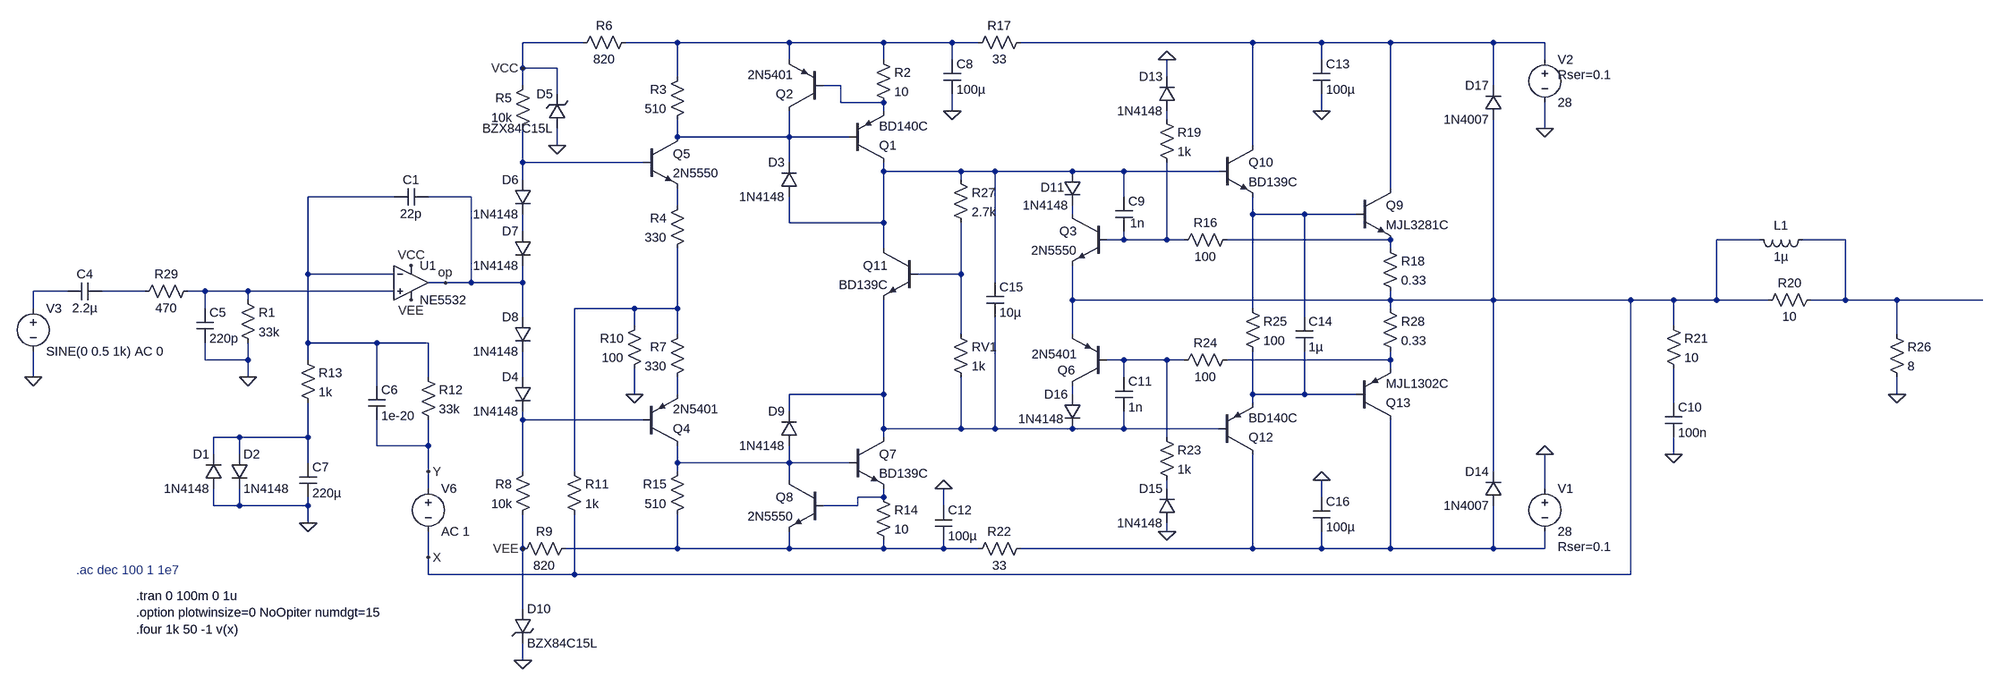
[diagram p0: schematic opamp-classabs.asc]
opamp-classabs.asc, the LTspice schematic file:
Version 4
SHEET 1 3044 900
WIRE 432 -272 320 -272
WIRE 608 -272 512 -272
WIRE 816 -272 608 -272
WIRE 992 -272 816 -272
WIRE 1120 -272 992 -272
WIRE 1168 -272 1120 -272
WIRE 1680 -272 1248 -272
WIRE 1808 -272 1680 -272
WIRE 1936 -272 1808 -272
WIRE 2128 -272 1936 -272
WIRE 2224 -272 2128 -272
WIRE 816 -240 816 -272
WIRE 992 -240 992 -272
WIRE 1120 -240 1120 -272
WIRE 1808 -240 1808 -272
WIRE 2224 -240 2224 -272
WIRE 320 -224 320 -272
WIRE 384 -224 320 -224
WIRE 608 -208 608 -272
WIRE 1520 -208 1520 -240
WIRE 320 -192 320 -224
WIRE 912 -192 880 -192
WIRE 2128 -192 2128 -272
WIRE 384 -176 384 -224
WIRE 912 -160 912 -192
WIRE 992 -160 912 -160
WIRE 992 -144 992 -160
WIRE 1120 -144 1120 -176
WIRE 1808 -144 1808 -176
WIRE 1520 -128 1520 -144
WIRE 2224 -112 2224 -160
WIRE 608 -96 608 -128
WIRE 816 -96 816 -144
WIRE 816 -96 608 -96
WIRE 928 -96 816 -96
WIRE 384 -80 384 -112
WIRE 1680 -80 1680 -272
WIRE 320 -48 320 -112
WIRE 544 -48 320 -48
WIRE 816 -48 816 -96
WIRE 992 -32 992 -48
WIRE 1136 -32 992 -32
WIRE 1200 -32 1136 -32
WIRE 1344 -32 1200 -32
WIRE 1440 -32 1344 -32
WIRE 1616 -32 1440 -32
WIRE 320 -16 320 -48
WIRE 1136 -16 1136 -32
WIRE 1936 0 1936 -272
WIRE 80 16 -80 16
WIRE 224 16 144 16
WIRE 1440 16 1440 -32
WIRE 608 32 608 0
WIRE 1344 48 1344 32
WIRE 1680 48 1680 16
WIRE 1776 48 1680 48
WIRE 1872 48 1776 48
WIRE 816 64 816 16
WIRE 992 64 992 -32
WIRE 992 64 816 64
WIRE 320 80 320 48
WIRE 1440 96 1440 80
WIRE 1440 96 1408 96
WIRE 1520 96 1520 -48
WIRE 1520 96 1440 96
WIRE 1552 96 1520 96
WIRE 1936 96 1632 96
WIRE 2624 96 2544 96
WIRE 2784 96 2704 96
WIRE 992 112 992 64
WIRE 1936 112 1936 96
WIRE -80 160 -80 16
WIRE 80 160 -80 160
WIRE 1136 160 1136 64
WIRE 1136 160 1056 160
WIRE 176 176 144 176
WIRE 224 176 224 16
WIRE 224 176 176 176
WIRE 320 176 320 144
WIRE 320 176 224 176
WIRE 1200 176 1200 -32
WIRE -528 192 -592 192
WIRE -384 192 -464 192
WIRE -272 192 -304 192
WIRE -192 192 -272 192
WIRE 80 192 -192 192
WIRE -192 208 -192 192
WIRE 1344 208 1344 144
WIRE 1936 208 1936 192
WIRE 1936 208 1344 208
WIRE 2128 208 2128 -128
WIRE 2128 208 1936 208
WIRE 2384 208 2128 208
WIRE 2464 208 2384 208
WIRE 2544 208 2544 96
WIRE 2544 208 2464 208
WIRE 2640 208 2544 208
WIRE 2784 208 2784 96
WIRE 2784 208 2720 208
WIRE 2880 208 2784 208
WIRE 3040 208 2880 208
WIRE -592 224 -592 192
WIRE -272 224 -272 192
WIRE 528 224 416 224
WIRE 608 224 608 112
WIRE 608 224 528 224
WIRE 1680 224 1680 48
WIRE 1936 224 1936 208
WIRE 320 240 320 176
WIRE 1776 240 1776 48
WIRE 528 256 528 224
WIRE 2464 256 2464 208
WIRE 608 272 608 224
WIRE 1136 272 1136 160
WIRE 1344 272 1344 208
WIRE 2880 272 2880 208
WIRE -80 288 -80 160
WIRE 48 288 -80 288
WIRE 144 288 48 288
WIRE -272 320 -272 288
WIRE -192 320 -192 288
WIRE -192 320 -272 320
WIRE -80 320 -80 288
WIRE 1440 320 1408 320
WIRE 1520 320 1440 320
WIRE 1552 320 1520 320
WIRE 1936 320 1936 304
WIRE 1936 320 1632 320
WIRE 1936 336 1936 320
WIRE -592 352 -592 304
WIRE -192 352 -192 320
WIRE 144 352 144 288
WIRE 320 352 320 304
WIRE 1440 352 1440 320
WIRE 48 368 48 288
WIRE 528 384 528 336
WIRE 608 384 608 352
WIRE 992 384 992 208
WIRE 992 384 816 384
WIRE 1344 384 1344 368
WIRE 1680 384 1680 304
WIRE 1776 384 1776 304
WIRE 1776 384 1680 384
WIRE 1872 384 1776 384
WIRE 2880 384 2880 352
WIRE 1680 400 1680 384
WIRE 2464 400 2464 336
WIRE 816 416 816 384
WIRE 320 432 320 416
WIRE 544 432 320 432
WIRE 992 448 992 384
WIRE 1136 448 1136 352
WIRE 1136 448 992 448
WIRE 1200 448 1200 240
WIRE 1200 448 1136 448
WIRE 1344 448 1200 448
WIRE 1440 448 1440 416
WIRE 1440 448 1344 448
WIRE 1616 448 1440 448
WIRE -208 464 -256 464
WIRE -80 464 -80 400
WIRE -80 464 -208 464
WIRE 992 464 992 448
WIRE 1520 464 1520 320
WIRE 48 480 48 432
WIRE 144 480 144 432
WIRE 144 480 48 480
WIRE -256 496 -256 464
WIRE -208 496 -208 464
WIRE 2464 496 2464 464
WIRE -80 512 -80 464
WIRE 608 512 608 480
WIRE 816 512 816 480
WIRE 816 512 608 512
WIRE 928 512 816 512
WIRE 144 528 144 480
WIRE 320 528 320 432
WIRE 416 528 416 224
WIRE 608 528 608 512
WIRE 2128 528 2128 208
WIRE 816 544 816 512
WIRE 144 560 144 528
WIRE 1520 560 1520 544
WIRE 2224 560 2224 496
WIRE 992 576 992 560
WIRE 992 576 944 576
WIRE 1808 576 1808 544
WIRE -256 592 -256 560
WIRE -208 592 -208 560
WIRE -208 592 -256 592
WIRE -80 592 -80 576
WIRE -80 592 -208 592
WIRE 944 592 944 576
WIRE 944 592 880 592
WIRE 1104 592 1104 560
WIRE -80 624 -80 592
WIRE 1520 640 1520 624
WIRE 320 672 320 608
WIRE 608 672 608 608
WIRE 608 672 400 672
WIRE 816 672 816 640
WIRE 816 672 608 672
WIRE 992 672 992 656
WIRE 992 672 816 672
WIRE 1104 672 1104 656
WIRE 1104 672 992 672
WIRE 1168 672 1104 672
WIRE 1680 672 1680 496
WIRE 1680 672 1248 672
WIRE 1808 672 1808 640
WIRE 1808 672 1680 672
WIRE 1936 672 1936 432
WIRE 1936 672 1808 672
WIRE 2128 672 2128 592
WIRE 2128 672 1936 672
WIRE 2224 672 2224 640
WIRE 2224 672 2128 672
WIRE 144 688 144 640
WIRE 144 720 144 688
WIRE 416 720 416 608
WIRE 416 720 144 720
WIRE 2384 720 2384 208
WIRE 2384 720 416 720
WIRE 320 784 320 672
WIRE 320 880 320 848
FLAG -80 624 0
FLAG 112 144 VCC
FLAG 112 208 VEE
FLAG 2880 384 0
FLAG 2224 -112 0
FLAG 2224 496 0
FLAG -592 352 0
FLAG 144 688 X
FLAG 144 528 Y
FLAG -192 352 0
FLAG 176 176 op
FLAG 528 384 0
FLAG 1120 -144 0
FLAG 1104 560 0
FLAG 2464 496 0
FLAG 1808 -144 0
FLAG 1808 544 0
FLAG 1520 640 0
FLAG 1520 -240 0
FLAG 384 -80 0
FLAG 320 880 0
FLAG 320 672 VEE
FLAG 320 -224 VCC
DATAFLAG 688 -96 ""
DATAFLAG 992 0 ""
DATAFLAG 992 352 ""
DATAFLAG 672 512 ""
DATAFLAG 496 -48 ""
DATAFLAG 448 432 ""
SYMBOL NE5532 112 176 R0
SYMATTR InstName U1
SYMBOL res -96 304 R0
SYMATTR InstName R13
SYMATTR Value 1k
SYMBOL cap -96 512 R0
SYMATTR InstName C7
SYMATTR Value 220µ
SYMBOL res 128 336 R0
SYMATTR InstName R12
SYMATTR Value 33k
SYMBOL res 624 16 M0
SYMATTR InstName R4
SYMATTR Value 330
SYMBOL res 624 256 M0
SYMATTR InstName R7
SYMATTR Value 330
SYMBOL npn 544 -96 R0
SYMATTR InstName Q5
SYMATTR Value 2N5550
SYMBOL res 624 512 M0
SYMATTR InstName R15
SYMATTR Value 510
SYMBOL res 624 -224 M0
SYMATTR InstName R3
SYMATTR Value 510
SYMBOL diode 336 -16 M0
SYMATTR InstName D6
SYMATTR Value 1N4148
SYMBOL diode 336 80 M0
SYMATTR InstName D7
SYMATTR Value 1N4148
SYMBOL diode 336 352 M0
SYMATTR InstName D4
SYMATTR Value 1N4148
SYMBOL res 336 512 M0
SYMATTR InstName R8
SYMATTR Value 10k
SYMBOL res 336 -208 M0
SYMATTR InstName R5
SYMATTR Value 10k
SYMBOL pnp 928 -48 M180
SYMATTR InstName Q1
SYMATTR Value BD140C
SYMBOL res 976 -256 R0
SYMATTR InstName R2
SYMATTR Value 10
SYMBOL npn 1056 112 M0
SYMATTR InstName Q11
SYMATTR Value BD139C
SYMBOL npn 928 464 R0
SYMATTR InstName Q7
SYMATTR Value BD139C
SYMBOL res 976 560 R0
SYMATTR InstName R14
SYMATTR Value 10
SYMBOL cap 1184 176 R0
SYMATTR InstName C15
SYMATTR Value 10µ
SYMBOL res 1120 -32 R0
SYMATTR InstName R27
SYMATTR Value 2.7k
SYMBOL res 1120 256 R0
SYMATTR InstName RV1
SYMATTR Value 1k
SYMBOL npn 1616 -80 R0
SYMATTR InstName Q10
SYMATTR Value BD139C
SYMBOL pnp 1616 496 M180
SYMATTR InstName Q12
SYMATTR Value BD140C
SYMBOL res 1664 208 R0
SYMATTR InstName R25
SYMATTR Value 100
SYMBOL cap 1760 240 R0
SYMATTR InstName C14
SYMATTR Value 1µ
SYMBOL npn 1872 0 R0
SYMATTR InstName Q9
SYMATTR Value MJL3281C
SYMBOL pnp 1872 432 M180
SYMATTR InstName Q13
SYMATTR Value MJL1302C
SYMBOL res 1920 96 R0
SYMATTR InstName R18
SYMATTR Value 0.33
SYMBOL res 1920 208 R0
SYMATTR InstName R28
SYMATTR Value 0.33
SYMBOL voltage 2224 544 R0
WINDOW 123 0 0 Left 0
WINDOW 39 24 124 Left 2
SYMATTR SpiceLine Rser=0.1
SYMATTR InstName V1
SYMATTR Value 28
SYMBOL voltage 2224 -256 R0
WINDOW 123 0 0 Left 0
WINDOW 39 24 44 Left 2
SYMATTR SpiceLine Rser=0.1
SYMATTR InstName V2
SYMATTR Value 28
SYMBOL voltage -592 208 R0
WINDOW 123 0 0 Left 0
WINDOW 39 0 0 Left 0
SYMATTR InstName V3
SYMATTR Value SINE(0 0.5 1k) AC 0
SYMBOL diode -224 496 R0
SYMATTR InstName D2
SYMATTR Value 1N4148
SYMBOL diode -240 560 R180
WINDOW 0 24 64 Left 2
WINDOW 3 24 0 Left 2
SYMATTR InstName D1
SYMATTR Value 1N4148
SYMBOL voltage 144 544 R0
SYMATTR InstName V6
SYMATTR Value AC 1
SYMBOL res -288 176 R90
WINDOW 0 0 56 VBottom 2
WINDOW 3 32 56 VTop 2
SYMATTR InstName R29
SYMATTR Value 470
SYMBOL cap -464 176 R90
WINDOW 0 0 32 VBottom 2
WINDOW 3 32 32 VTop 2
SYMATTR InstName C4
SYMATTR Value 2.2µ
SYMBOL res -208 192 R0
SYMATTR InstName R1
SYMATTR Value 33k
SYMBOL res 400 512 R0
SYMATTR InstName R11
SYMATTR Value 1k
SYMBOL res 544 240 M0
SYMATTR InstName R10
SYMATTR Value 100
SYMBOL diode 336 240 M0
SYMATTR InstName D8
SYMATTR Value 1N4148
SYMBOL diode 832 16 R180
WINDOW 0 24 64 Left 2
WINDOW 3 24 0 Left 2
SYMATTR InstName D3
SYMATTR Value 1N4148
SYMBOL diode 832 480 R180
WINDOW 0 24 64 Left 2
WINDOW 3 24 0 Left 2
SYMATTR InstName D9
SYMATTR Value 1N4148
SYMBOL res 1264 -288 R90
WINDOW 0 0 56 VBottom 2
WINDOW 3 32 56 VTop 2
SYMATTR InstName R17
SYMATTR Value 33
SYMBOL cap 1104 -240 R0
SYMATTR InstName C8
SYMATTR Value 100µ
SYMBOL res 1264 656 R90
WINDOW 0 0 56 VBottom 2
WINDOW 3 32 56 VTop 2
SYMATTR InstName R22
SYMATTR Value 33
SYMBOL cap 1088 592 R0
SYMATTR InstName C12
SYMATTR Value 100µ
SYMBOL npn 1408 48 M0
SYMATTR InstName Q3
SYMATTR Value 2N5550
SYMBOL diode 1360 -32 M0
WINDOW 0 31 30 Left 2
SYMATTR InstName D11
SYMATTR Value 1N4148
SYMBOL diode 1360 384 M0
WINDOW 3 32 46 Left 2
SYMATTR Value 1N4148
SYMATTR InstName D16
SYMBOL res 1648 80 R90
WINDOW 0 0 56 VBottom 2
WINDOW 3 32 56 VTop 2
SYMATTR InstName R16
SYMATTR Value 100
SYMBOL res 1648 304 R90
WINDOW 0 0 56 VBottom 2
WINDOW 3 32 56 VTop 2
SYMATTR InstName R24
SYMATTR Value 100
SYMBOL cap 1424 16 R0
WINDOW 3 27 49 Left 2
SYMATTR Value 1n
SYMATTR InstName C9
SYMBOL cap 1424 352 R0
SYMATTR InstName C11
SYMATTR Value 1n
SYMBOL res 2448 240 R0
SYMATTR InstName R21
SYMATTR Value 10
SYMBOL cap 2448 400 R0
SYMATTR InstName C10
SYMATTR Value 100n
SYMBOL npn 880 544 M0
SYMATTR InstName Q8
SYMATTR Value 2N5550
SYMBOL cap 144 0 R90
WINDOW 0 0 32 VBottom 2
WINDOW 3 32 32 VTop 2
SYMATTR InstName C1
SYMATTR Value 22p
SYMBOL pnp 544 480 M180
SYMATTR InstName Q4
SYMATTR Value 2N5401
SYMBOL pnp 880 -144 R180
SYMATTR InstName Q2
SYMATTR Value 2N5401
SYMBOL pnp 1408 368 R180
WINDOW 0 59 29 Left 2
WINDOW 3 55 59 Left 2
SYMATTR InstName Q6
SYMATTR Value 2N5401
SYMBOL cap 1792 -240 R0
SYMATTR InstName C13
SYMATTR Value 100µ
SYMBOL cap 1792 576 R0
SYMATTR InstName C16
SYMATTR Value 100µ
SYMBOL diode 1536 624 R180
WINDOW 0 24 64 Left 2
WINDOW 3 24 0 Left 2
SYMATTR InstName D15
SYMATTR Value 1N4148
SYMBOL diode 1536 -144 R180
WINDOW 0 24 64 Left 2
WINDOW 3 24 0 Left 2
SYMATTR InstName D13
SYMATTR Value 1N4148
SYMBOL diode 2144 -128 R180
WINDOW 0 24 64 Left 2
WINDOW 3 24 0 Left 2
SYMATTR InstName D17
SYMATTR Value 1N4007
SYMBOL diode 2144 592 R180
WINDOW 0 24 64 Left 2
WINDOW 3 24 0 Left 2
SYMATTR InstName D14
SYMATTR Value 1N4007
SYMBOL res 1504 -144 R0
SYMATTR InstName R19
SYMATTR Value 1k
SYMBOL res 1504 448 R0
SYMATTR InstName R23
SYMATTR Value 1k
SYMBOL cap -288 224 R0
SYMATTR InstName C5
SYMATTR Value 220p
SYMBOL res 528 -288 R90
WINDOW 0 0 56 VBottom 2
WINDOW 3 32 56 VTop 2
SYMATTR InstName R6
SYMATTR Value 820
SYMBOL zener 400 -112 R180
WINDOW 0 24 64 Left 2
WINDOW 3 24 0 Left 2
SYMATTR InstName D5
SYMATTR Value BZX84C15L
SYMATTR Description Diode
SYMATTR Type diode
SYMBOL res 416 656 R90
WINDOW 0 0 56 VBottom 2
WINDOW 3 32 56 VTop 2
SYMATTR InstName R9
SYMATTR Value 820
SYMBOL zener 304 784 R0
SYMATTR InstName D10
SYMATTR Value BZX84C15L
SYMATTR Description Diode
SYMATTR Type diode
SYMBOL res 2736 192 R90
WINDOW 0 0 56 VBottom 2
WINDOW 3 32 56 VTop 2
SYMATTR InstName R20
SYMATTR Value 10
SYMBOL ind 2720 80 R90
WINDOW 0 5 56 VBottom 2
WINDOW 3 32 56 VTop 2
SYMATTR InstName L1
SYMATTR Value 1µ
SYMBOL res 2864 256 R0
SYMATTR InstName R26
SYMATTR Value 8
SYMBOL cap 32 368 R0
SYMATTR InstName C6
SYMATTR Value 1e-20
TEXT -512 712 Left 2 ;.ac dec 100 1 1e7
TEXT -400 760 Left 2 !.tran 0 100m 0 1u\n.option plotwinsize=0 NoOpiter numdgt=15\n.four 1k 50 -1 v(x)

The netlist it stands for:
* opamp-classabs.asc
* U1: NE5532 (symbol NE5532 not available, pins judged from their places): In+=N019 In-=N008 V+=VCC V-=VEE OUT=op
R13 N008 N030 1k
C7 N030 0 220µ
R12 N008 Y 33k
R4 N009 N020 330
R7 N020 N024 330
Q5 N005 N006 N009 0 2N5550
R15 N031 N034 510
R3 N001 N005 510
D6 N006 N012 1N4148
D7 N012 op 1N4148
D4 N023 N029 1N4148
R8 N029 VEE 10k
R5 VCC N006 10k
Q1 N007 N005 N003 0 BD140C
R2 N001 N003 10
Q11 N007 N016 N025 0 BD139C
Q7 N025 N031 N033 0 BD139C
R14 N033 N034 10
C15 N007 N025 10µ
R27 N007 N016 2.7k
RV1 N016 N025 1k
Q10 N002 N007 N011 0 BD139C
Q12 N035 N025 N027 0 BD140C
R25 N011 N027 100
C14 N011 N027 1µ
Q9 N002 N011 N014 0 MJL3281C
Q13 N035 N027 N022 0 MJL1302C
R18 N014 X 0.33
R28 X N022 0.33
V1 0 N035 28 Rser=0.1
V2 N002 0 28 Rser=0.1
V3 N017 0 SINE(0 0.5 1k) AC 0
D2 N030 0 1N4148
D1 0 N030 1N4148
V6 Y X AC 1
R29 N019 N018 470
C4 N018 N017 2.2µ
R1 N019 0 33k
R11 N020 X 1k
R10 N020 0 100
D8 op N023 1N4148
D3 N007 N005 1N4148
D9 N031 N025 1N4148
R17 N002 N001 33
C8 N001 0 100µ
R22 N035 N034 33
C12 0 N034 100µ
Q3 N010 N013 X 0 2N5550
D11 N007 N010 1N4148
D16 N026 N025 1N4148
R16 N014 N013 100
R24 N022 N021 100
C9 N007 N013 1n
C11 N021 N025 1n
R21 X N028 10
C10 N028 0 100n
Q8 N031 N033 N034 0 2N5550
C1 op N008 22p
Q4 N031 N029 N024 0 2N5401
Q2 N005 N003 N001 0 2N5401
Q6 N026 N021 X 0 2N5401
C13 N002 0 100µ
C16 0 N035 100µ
D15 0 N032 1N4148
D13 N004 0 1N4148
D17 X N002 1N4007
D14 N035 X 1N4007
R19 N004 N013 1k
R23 N021 N032 1k
C5 N019 0 220p
R6 N001 VCC 820
D5 0 VCC BZX84C15L
R9 N034 VEE 820
D10 VEE 0 BZX84C15L
R20 N015 X 10
L1 N015 X 1µ
R26 N015 0 8
C6 N008 Y 1e-20
.model D D
.lib standard.dio
.model NPN NPN
.model PNP PNP
.lib standard.bjt
* .ac dec 100 1 1e7
.tran 0 100m 0 1u
.option plotwinsize=0 NoOpiter numdgt=15
.four 1k 50 -1 v(x)
.backanno
.end